# Altium schematic sheet Connectors.SchDoc: Connectors
size A4; ApprovedBy: LD Stanton; CheckedBy: None; Author: LD Stanton; CompanyName: University of Cape Town; DrawnBy: Lawrence Stanton; Engineer: Lawrence Stanton; Organization: University of Cape Town; Address1: Department of Electrical Engineering; Address2: Rondebosch; Address3: Cape Town; Address4: South Africa 7701; DocumentNumber: 3; SheetNumber: 3; SheetTotal: 20; Approv_Date_Eng: --/--/----; Approv_Date_Chk: --/--/----; PCB_Doc: TBD; ASM_Doc: TBD; FAB_Doc: TBD; CML_Doc: TBD; BOM_Doc: TBD
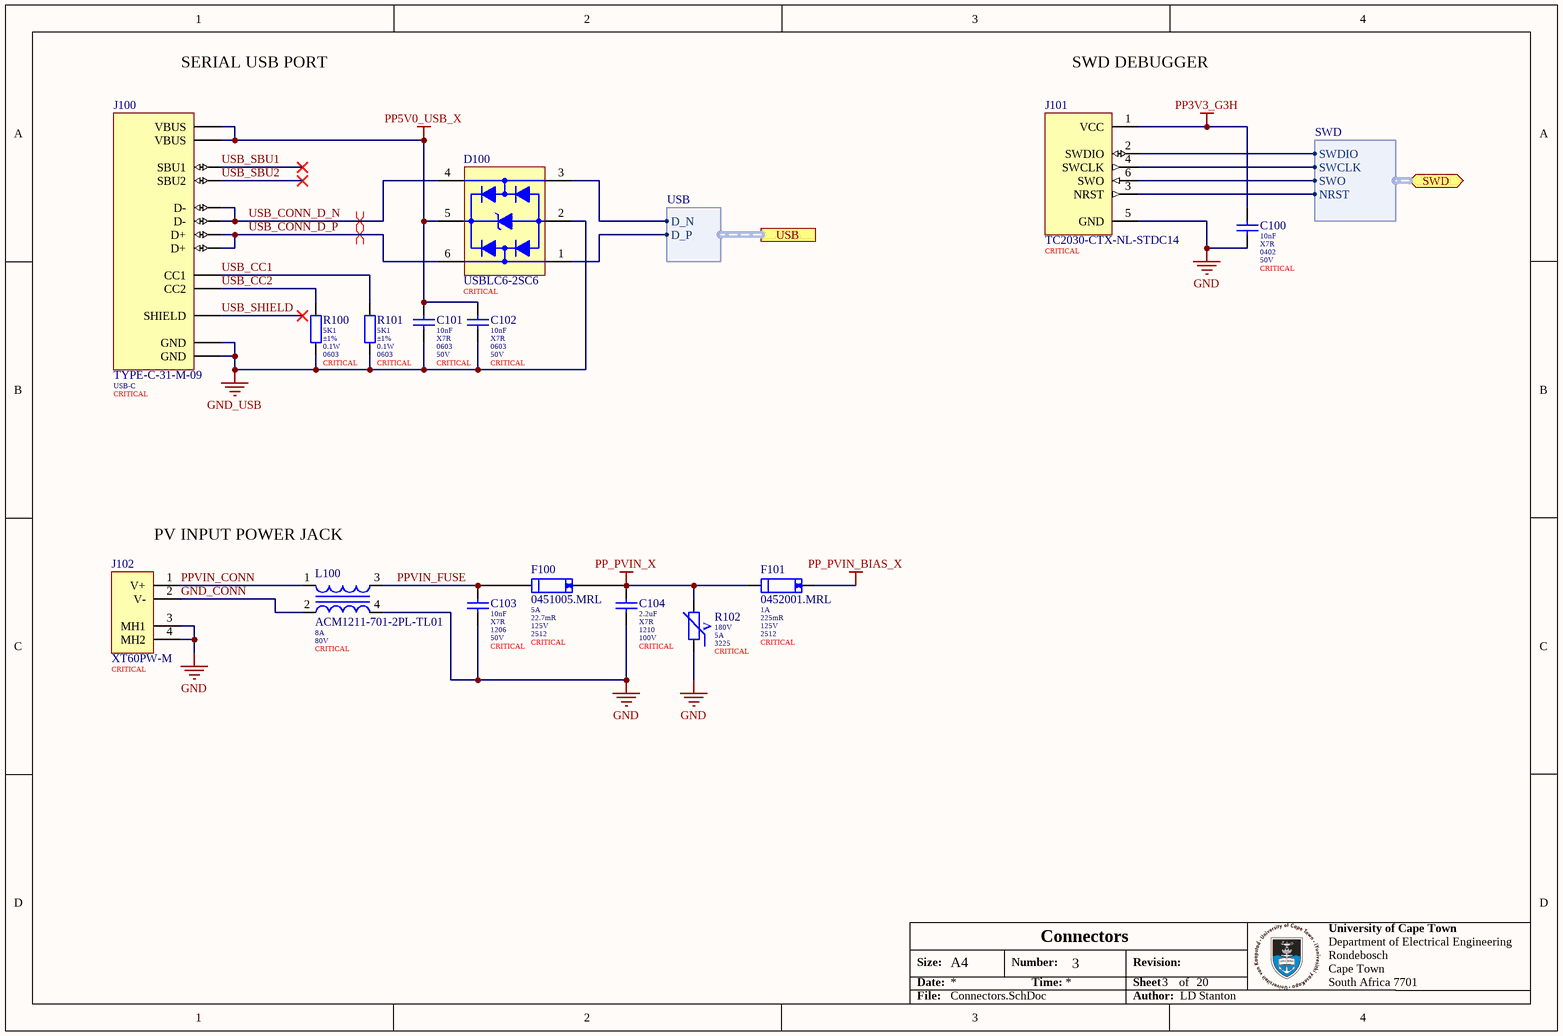
[diagram p0: Connectors.SchDoc]

## Parts
C100  value 10nF  Dielectric: X7R  Package: 0402  Voltage: 50V  Populate: CRITICAL  [0402_050_5 (Samsumg) B]  (hidden comment: CL05B103KB5NNNC)
C101  value 10nF  Dielectric: X7R  Package: 0603  Voltage: 50V  Populate: CRITICAL  [0603_080 (Guandong) B]  (hidden comment: 0603B103K500NT)
C102  value 10nF  Dielectric: X7R  Package: 0603  Voltage: 50V  Populate: CRITICAL  [0603_080 (Guandong) B]  (hidden comment: 0603B103K500NT)
C103  value 10nF  Dielectric: X7R  Package: 1206  Voltage: 50V  Populate: CRITICAL  [1206_125 (Guandong) B]  (hidden comment: 1206B103K500NT)
C104  value 2.2uF  Dielectric: X7R  Package: 1210  Voltage: 100V  Populate: CRITICAL  [1212_250_J (Samsumg) B]  (hidden comment: CL32B225KCJSNNE)
D100  USBLC6-2SC6  Placement: CRITICAL  [SOT-23-6 (USBLC6-2SC6 ST) B]
F100  0451005.MRL  Current: 5A  Resistance: 22.7mR  Voltage: 125V  Package: 2512  Placement: CRITICAL  [Littlefuse 45x B]
F101  0452001.MRL  Current: 1A  Resistance: 225mR  Voltage: 125V  Package: 2512  Placement: CRITICAL  [Littlefuse 45x B]
J100  TYPE-C-31-M-09  Type: USB-C  Placement: CRITICAL  [TYPE-C-31-M-09_OVH]
J101  TC2030-CTX-NL-STDC14  Placement: CRITICAL  [TC2030 NL]  (no BOM)
J102  XT60PW-M  Placement: CRITICAL  [XT60-PW_OVH]
L100  ACM1211-701-2PL-TL01  Current: 8A  Voltage: 80V  Placement: CRITICAL  [ACM1211]
R100  value 5K1  Tolerance: ±1%  Power: 0.1W  Package: 0603  Populate: CRITICAL  [0603 (Uniroyal) B]  (hidden comment: 0603WAF5101T5E)
R101  value 5K1  Tolerance: ±1%  Power: 0.1W  Package: 0603  Populate: CRITICAL  [0603 (Uniroyal) B]  (hidden comment: 0603WAF5101T5E)
R102  Varistor Voltage: 180V  Clamping Current: 5A  Package: 3225  Placement: CRITICAL  [3225 (B726) B]  (hidden comment: B72650M0111K072)

## Ports
SWD (bidir, harness SWD), USB (harness USB)

## Harnesses
USB: D_P, D_N
SWD: SWCLK, SWDIO, NRST, SWO

## Nets
GND: C100.2 C103.2 C104.2 J101.5(GND) J102.3(MH1) J102.4(MH2) L100.4 R102.1
GND_USB: C101.2 C102.2 D100.2(GND) J100.A1B12(GND) J100.B1A12(GND) R100.2 R101.2
PP3V3_G3H: C100.1 J101.1(VCC)
PP5V0_USB_X: C101.1 C102.1 D100.5(VBUS) J100.A4B9(VBUS) J100.B4A9(VBUS)
PP_PVIN_BIAS_X: F101.2
PP_PVIN_X: C104.1 F100.2 F101.1 R102.2
GND_CONN: J102.2(V-) L100.2
PPVIN_CONN: J102.1(V+) L100.1
PPVIN_FUSE: C103.1 F100.1 L100.3
USB_CC1: J100.A5(CC1) R101.1
USB_CC2: J100.B5(CC2) R100.1
USB_CONN_D_N: D100.4(I/O_3) J100.A7(D-) J100.B7(D-)
USB_CONN_D_P: D100.6(I/O_4) J100.A6(D+) J100.B6(D+)
USB_SBU1: J100.A8(SBU1)
USB_SBU2: J100.B8(SBU2)
USB_SHIELD: J100.1(SHIELD)
NetD100_1: D100.1(I/O_1) ; port USB.D_P
NetD100_3: D100.3(I/O_2) ; port USB.D_N
NetJ101_2: J101.2(SWDIO) ; port SWD.SWDIO
NetJ101_3: J101.3(NRST) ; port SWD.NRST
NetJ101_4: J101.4(SWCLK) ; port SWD.SWCLK
NetJ101_6: J101.6(SWO) ; port SWD.SWO

## Layout directives
differential pair: USB_CONN_D_N, USB_CONN_D_P

## Notes on the sheet
- SERIAL USB PORT
- SWD DEBUGGER
- PV INPUT POWER JACK
- Size:
- Date:
- A4
- Number:
- Time:
- Revision:
- Sheet
- of
- File:
- Author:
- (in symbol CMP-000045-3) V

## Library data of the parts
C100 = CMP-045-000005-9: MLCC 10nF 0402 50V X7R ±10%; Manufacturer: Samsung; ComponentLink1URL: https://datasheet.lcsc.com/szlcsc/Samsung-Electro-Mechanics-CL05C100JB5NNNC_C32949.pdf; Tolerance: ±10%; LCSC Part Number: C15195; ComponentLink1Description: Datasheet
C101 C102 = CMP-014-000000-11: MLCC 10nF 0603 50V X7R ±10%; Manufacturer: Guandong; Tolerance: ±15%; ComponentLink1Description: Datasheet; LCSC Part Number: C57112; ComponentLink1URL: https://datasheet.lcsc.com/szlcsc/Guangdong-Fenghua-Advanced-Tech-0402B102K500NT_C1523.pdf
C103 = CMP-014-000019-1: MLCC 10nF 1206 50V X7R ±10%; Manufacturer: Guandong; ComponentLink1URL: https://datasheet.lcsc.com/szlcsc/Guangdong-Fenghua-Advanced-Tech-0402B102K500NT_C1523.pdf; Tolerance: ±10%; LCSC Part Number: C1846; ComponentLink1Description: Datasheet
C104 = CMP-014-000010-1: MLCC 2.2uF 1210 100V X7R ±10%; Manufacturer: Samsung; LCSC Part Number: C55151; Tolerance: ±10%; ComponentLink1URL: https://datasheet.lcsc.com/szlcsc/Samsung-Electro-Mechanics-CL05C100JB5NNNC_C32949.pdf; ComponentLink1Description: Datasheet
D100 = CMP-004-00000-1: TVS Diode Array Low Capacitance SOT23-6; Manufacturer: Tech Public; Peak Pulse Current: 5A; Breakdown Voltage: 6V; Leakage Current: 150nA; Capacitance: 3.5pF; Data Rate: 480Mbps; Clamping Voltage: 17V; Max Operating Temperature: 125°C; Case/Package: SOT-23-6; ComponentLink1URL: https://datasheet.lcsc.com/lcsc/2108132230_TECH-PUBLIC-USBLC6-2SC6_C2827654.pdf; ComponentLink1Description: Datasheet; Min Operating Temperature: -40°C; RoHS Compliant: Yes; LCSC Part Number: C2827654
F100 = CMP-005-00002-1: Fuse 5A 125VAC/VDCSMD Littlefuse; Body Material: Ceramic; LCSC Part Number: C48467; Max Operating Temperature: 125°C; ComponentLink1Description: Datasheet; ComponentLink1URL: https://datasheet.lcsc.com/lcsc/1809291113_Littelfuse-0451010.MRL_C44479.pdf; Min Operating Temperature: -55°C; RoHS Compliant: Yes
F101 = CMP-005-00001-1: Fuse 1A 125VAC/VDC SMD Littlefuse; Body Material: Ceramic; RoHS Compliant: Yes; Max Operating Temperature: 125°C; Min Operating Temperature: -55°C; ComponentLink1URL: https://datasheet.lcsc.com/lcsc/1809191823_Littelfuse-0452001.MRL_C44669.pdf; LCSC Part Number: C44669; ComponentLink1Description: Datasheet
J100 = CMP-016-000003-6: USB Type C Jack USB2.0 SMD/TH; LCSC Part Number: C2689967; ComponentLink1URL: https://datasheet.lcsc.com/lcsc/2103221609_Korean-Hroparts-Elec-TYPE-C-31-M-09_C2689967.pdf; ComponentLink1Description: Drawing
J101 = CMP-000037-4: 6-Pin Plug-of-nails connector for SWD; ComponentLink1Description: Datasheet; ComponentLink1URL: https://www.tag-connect.com/wp-content/uploads/bsk-pdf-manager/TC2030-CTX_1.pdf
J102 = CMP-000030-3: DC Power Connector 500V 30A 0.50mR; DC Resistance: 0.5mR; Peak Current: 60A; LCSC Part Number: C98732; Insulation Rating: 500V; ComponentLink1URL: https://datasheet.lcsc.com/lcsc/1810251313_Changzhou-Amass-Elec-XT60PW-M_C98732.pdf; Rated Current: 30A; ComponentLink1Description: Datasheet
L100 = CMP-000044-4: Common Mode Choke 6mR 80V 8A 700R @ 100MHz; Min Operating Temperature: -40°C; Impedance: 700R; RoHS Compliant: Yes; Max Operating Temperature: 85°C; LCSC Part Number: C250214
R100 R101 = CMP-010-000393-1: Resistor 5K1 0603 ±1% Thick Film Uniroyal; Temperature Coefficient: ±100ppm/K; Working Voltage: 50V; LCSC Part Number: C23186; Pin Count: 2; Manufacturer: Uniroyal; Temperature: -55 - 155°C; ComponentLink1Description: Datasheet; ComponentLink1URL: https://datasheet.lcsc.com/szlcsc/1811062009_UNI-ROYAL-Uniroyal-Elec-0603WAF1002T5E_C25804.pdf
R102 = CMP-000045-3: Varistor MLV 115VAC/150VDC Rated 400A Peak 180V Trigger 3225; Capacitance: 110pF; Max Surge Current: 100A; Voltage Rating (AC): 115V; Voltage Rating (DC): 150V; Clamping Voltage: 36V; Min Operating Temperature: -40°C; Max Operating Temperature: 85°C; Max Voltage Rating (DC): 150V; RoHS Compliant: Yes; LCSC Part Number: C211089